# EAGLE schematic board (EAGLE 6.4)
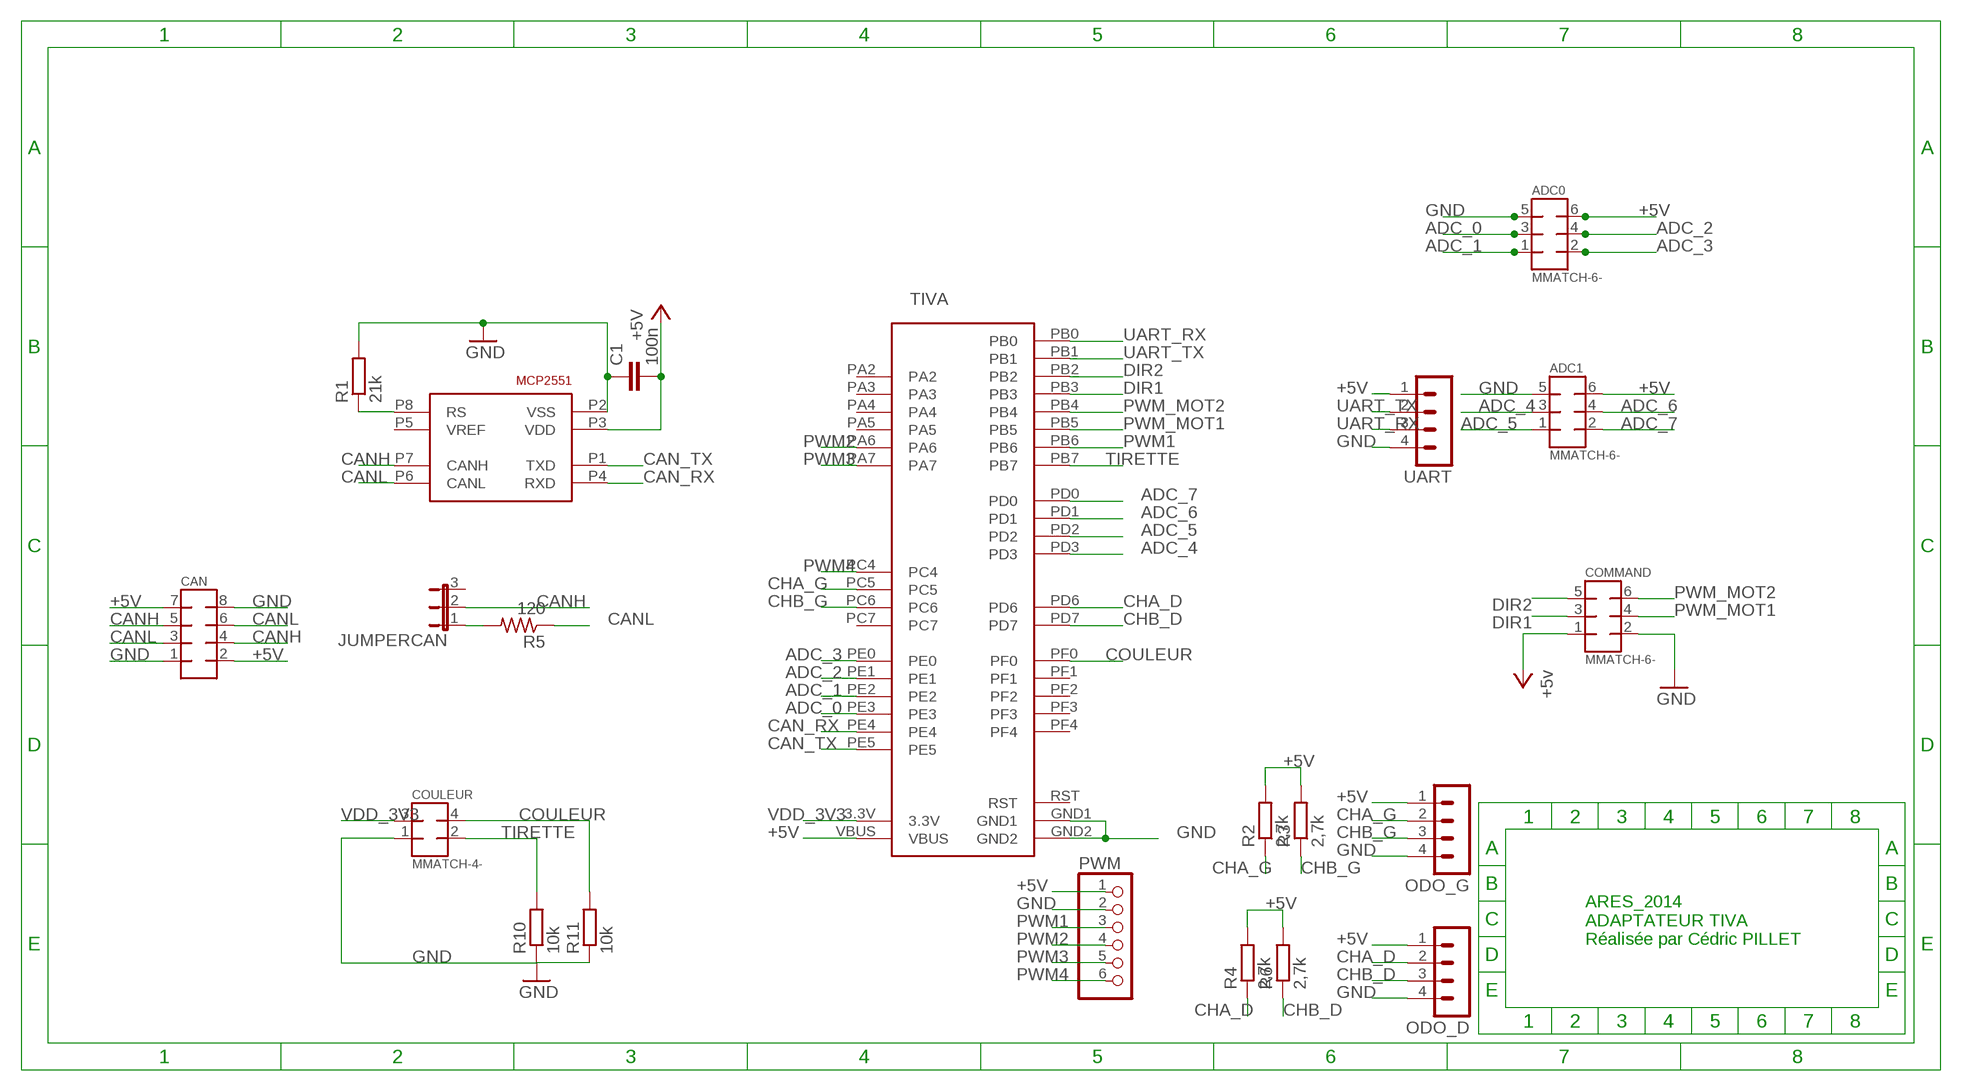
[diagram p0: schematic, sheet 1]

## Parts
ADC0  MMATCH-6-  [AMP-215079-6]
ADC1  MMATCH-6-  [AMP-215079-6]
C1  100n  C-EUC0805  [C0805]
CAN  MMATCH-8-PTH  [AMP-215079-8]
COMMAND  MMATCH-6-  [AMP-215079-6]
COULEUR  MMATCH-4-  [AMP-215079-4]
JUMPERCAN  JP2W  [JP2W]
ODO_D  MA04-1  [MA04-1]
ODO_G  MA04-1  [MA04-1]
PWM  PINHD-1X6/90  [1X06/90]
R1  21k  R-EU_R0805  [R0805]
R2  2,7k  R-EU_R0805  [R0805]
R3  2,7k  R-EU_R0805  [R0805]
R4  2,7k  R-EU_R0805  [R0805]
R5  120  R-US_M0805  [M0805]
R6  2,7k  R-EU_R0805  [R0805]
R10  10k  R-EU_R0805  [R0805]
R11  10k  R-EU_R0805  [R0805]
TIVA  STELLARIS-LAUNCHPADSTELLARIS-LAUNCHPAD  [LAUNCHPAD-XL]
U$1  MCP2551  [SOIC_8]
UART  MA04-1  [MA04-1]

## Nets
+5V [+5V]: ADC0.6 ADC1.6 C1.2 CAN.2 CAN.7 COMMAND.1 ODO_D.1 ODO_G.1 PWM.1 R2.2 R3.2 R4.2 R6.2 TIVA.VBUS U$1.P3(VDD) UART.1 ; supply symbol labelled +5v
ADC_0: ADC0.3 TIVA.PE3
ADC_1: ADC0.1 TIVA.PE2
ADC_2: ADC0.4 TIVA.PE1
ADC_3: ADC0.2 TIVA.PE0
ADC_4: ADC1.3 TIVA.PD3
ADC_5: ADC1.1 TIVA.PD2
ADC_6: ADC1.4 TIVA.PD1
ADC_7: ADC1.2 TIVA.PD0
CAN_RX: TIVA.PE4 U$1.P4(RXD)
CAN_TX: TIVA.PE5 U$1.P1(TXD)
CANH: CAN.4 CAN.5 JUMPERCAN.2 U$1.P7(CANH)
CANL: CAN.3 CAN.6 R5.1 U$1.P6(CANL)
CHA_D: ODO_D.2 R4.1 TIVA.PD6
CHA_G: ODO_G.2 R2.1 TIVA.PC5
CHB_D: ODO_D.3 R6.1 TIVA.PD7
CHB_G: ODO_G.3 R3.1 TIVA.PC6
COULEUR: COULEUR.4 R11.2 TIVA.PF0
DIR1: COMMAND.3 TIVA.PB3
DIR2: COMMAND.5 TIVA.PB2
GND: ADC0.5 ADC1.5 C1.1 CAN.1 CAN.8 COMMAND.2 COULEUR.1 ODO_D.4 ODO_G.4 PWM.2 R1.2 R10.1 R11.1 TIVA.GND1 TIVA.GND2 U$1.P2(VSS) UART.4
N$1: R1.1 U$1.P8(RS)
N$9: JUMPERCAN.1 R5.2
PWM1: PWM.3 TIVA.PB6
PWM2: PWM.4 TIVA.PA6
PWM3: PWM.5 TIVA.PA7
PWM4: PWM.6 TIVA.PC4
PWM_MOT1: COMMAND.4 TIVA.PB5
PWM_MOT2: COMMAND.6 TIVA.PB4
TIRETTE: COULEUR.2 R10.2 TIVA.PB7
UART_RX: TIVA.PB0 UART.3
UART_TX: TIVA.PB1 UART.2
VDD_3V3: COULEUR.3 TIVA.3.3V
Unconnected: JUMPERCAN.3 TIVA.PA2 TIVA.PA3 TIVA.PA4 TIVA.PA5 TIVA.PC7 TIVA.PF1 TIVA.PF2 TIVA.PF3 TIVA.PF4 U$1.P5(VREF)

## Notes on the sheet
- ARES_2014
  ADAPTATEUR TIVA
  Réalisée par Cédric PILLET

## Power pins joined to a net without a drawn wire
RST: TIVA.RST

## Library data of the parts
ADC0 ADC1 COMMAND = jt-con-micromatch:MMATCH-6-*
C1 = rcl:C-EU: CAPACITOR, European symbol
CAN = jt-con-micromatch:MMATCH-8-*: AMP Micromatch 8-pin
COULEUR = jt-con-micromatch:MMATCH-4-*
JUMPERCAN = jumper:JP2W: JUMPER
ODO_D ODO_G UART = con-lstb:MA04-1: PIN HEADER; OC_FARNELL: unknown; OC_NEWARK: unknown
PWM = pinhead:PINHD-1X6: PIN HEADER
R1-R4 R6 R10 R11 = rcl:R-EU_: RESISTOR, European symbol
R5 = rcl:R-US_: RESISTOR, American symbol
TIVA = fabhack:STELLARIS-LAUNCHPAD: Stellaris Launchpad LM4F120 using all header pins to connect to XL booster packs.
U$1 = microchip:MCP2551

## Net classes
1 +5V: width 0.6 mm, drill 0.2 mm, clearance 0.4 mm